# EAGLE schematic schemat (EAGLE 9.2.2)
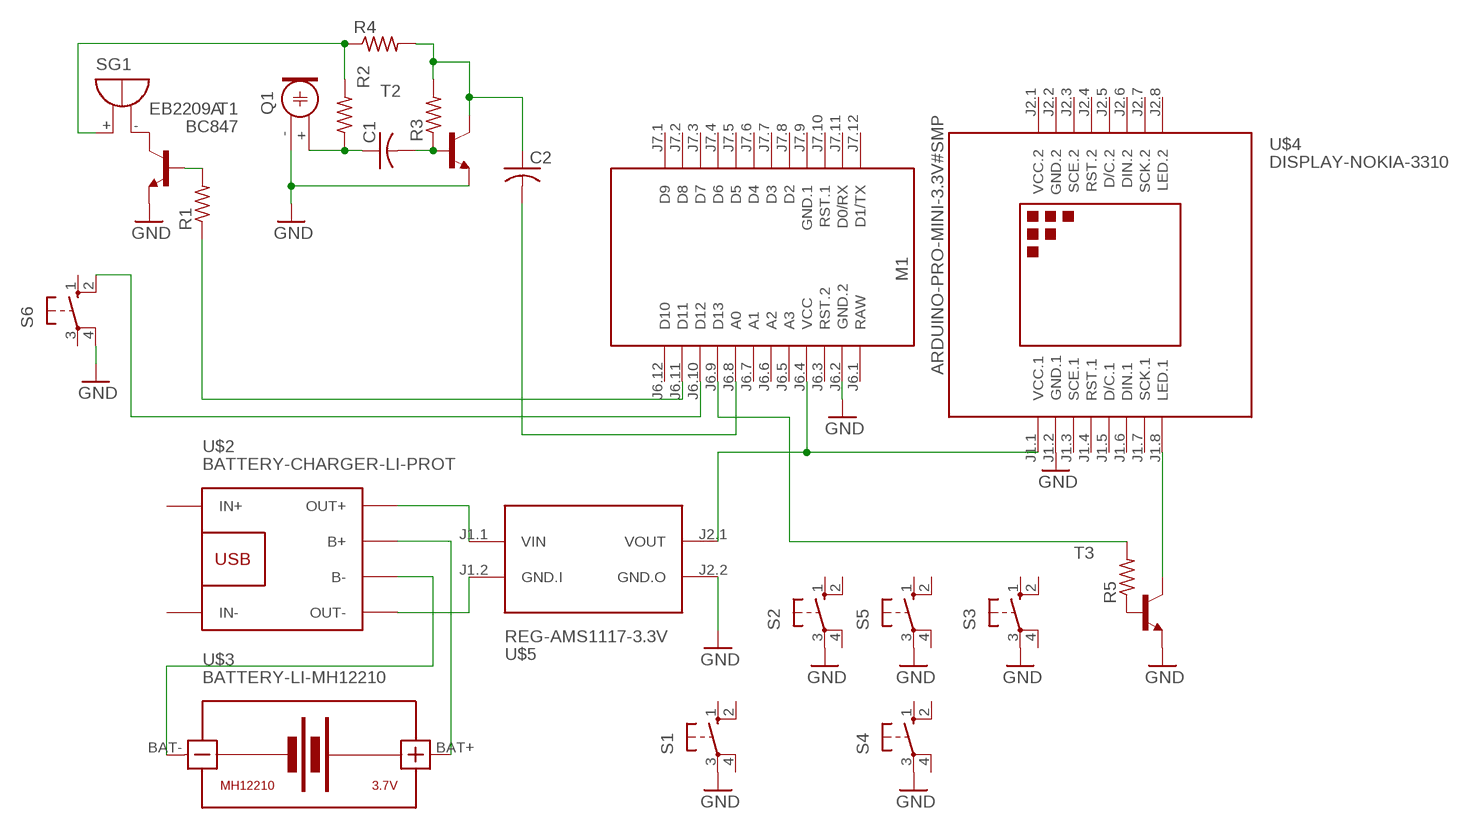
[diagram p0: schematic, sheet 1]

## Parts
C1  C-USC2012  [C2012]
C2  C-USC2012  [C2012]
M1  ARDUINO-PRO-MINI-3.3V#SMP  [ARDUINO-PRO-MINI#SMP]
Q1  ELECTRET  [9.7ELECTRET]
R1  R-US_R1206  [R1206]
R2  R-US_R1206  [R1206]
R3  R-US_R1206  [R1206]
R4  R-US_R1206  [R1206]
R5  R-US_R1206  [R1206]
S1  10-XX  [B3F-10XX]
S2  10-XX  [B3F-10XX]
S3  10-XX  [B3F-10XX]
S4  10-XX  [B3F-10XX]
S5  10-XX  [B3F-10XX]
S6  10-XX  [B3F-10XX]
SG1  EB2209A  [EB2209A]
T1  BC847  [SOT23]
T2  -NPN-SOT23-EBC  [SOT23-EBC]
T3  -NPN-SOT23-EBC  [SOT23-EBC]
U$2  BATTERY-CHARGER-LI-PROT  [BATTERY-CHARGER-LI-PROT]
U$3  BATTERY-LI-MH12210  [BATTERY-LI-MH12210]
U$4  DISPLAY-NOKIA-3310  [DISPLAY-NOKIA-3310]
U$5  REG-AMS1117-3.3V  [REG-AMS1117]

## Nets
GND: M1.J6.2(GND.2) Q1.- S1.3(P) S2.3(P) S3.3(P) S4.3(P) S5.3(P) S6.4(P1) T1.2(E) T2.E T3.E U$4.J1.2(GND.1) U$5.J2.2(GND.O)
N$1: SG1.- T1.3(C)
N$2: U$2.B- U$3.BAT-
N$3: U$2.B+ U$3.BAT+
N$4: U$2.OUT+ U$5.J1.1(VIN)
N$5: U$2.OUT- U$5.J1.2(GND.I)
N$6: R1.2 T1.1(B)
N$7: M1.J6.4(VCC) U$4.J1.1(VCC.1) U$5.J2.1(VOUT)
N$8: C1.1 Q1.+ R2.1
N$9: R2.2 R4.1 SG1.+
N$10: C1.2 R3.1 T2.B
N$11: C2.1 R3.2 R4.2 T2.C
N$12: C2.2 M1.J6.8(A0)
N$13: M1.J6.10(D12) S6.2(S1)
N$14: M1.J6.11(D11) R1.1
N$15: T3.C U$4.J1.8(LED.1)
N$16: R5.1 T3.B
N$17: M1.J6.9(D13) R5.2
Unconnected: M1.J6.3(RST.2) M1.J6.5(A3) M1.J6.6(A2) M1.J6.7(A1) M1.J6.12(D10) M1.J7.1(D9) M1.J7.2(D8) M1.J7.3(D7) M1.J7.4(D6) M1.J7.5(D5) M1.J7.6(D4) M1.J7.7(D3) M1.J7.8(D2) M1.J7.10(RST.1) M1.J7.11(D0/RX) M1.J7.12(D1/TX) S1.1(S) S1.2(S1) S1.4(P1) S2.1(S) S2.2(S1) S2.4(P1) S3.1(S) S3.2(S1) S3.4(P1) S4.1(S) S4.2(S1) S4.4(P1) S5.1(S) S5.2(S1) S5.4(P1) S6.1(S) S6.3(P) U$2.IN+ U$2.IN- U$4.J1.3(SCE.1) U$4.J1.4(RST.1) U$4.J1.5(D/C.1) U$4.J1.6(DIN.1) U$4.J1.7(SCK.1) U$4.J2.3(SCE.2) U$4.J2.4(RST.2) U$4.J2.5(D/C.2) U$4.J2.6(DIN.2) U$4.J2.7(SCK.2) U$4.J2.8(LED.2)

## Power pins joined to a net without a drawn wire
GND.1: M1.J7.9(GND.1)
GND.2: U$4.J2.2(GND.2)
RAW: M1.J6.1(RAW)
VCC.2: U$4.J2.1(VCC.2)

## Library data of the parts
C1 C2 = adafruit:C-US: CAPACITOR, American symbol
M1 = diy-modules:ARDUINO-PRO-MINI-*#SMP: Arduino Pro Mini (and compatible devices) with 2 connectors only More details available here: https://www.arduino.cc/en/Main/ArduinoBoardProMini Click here to find device on ebay.com <http://www.ebay.com/sch/arduino+pro+mini>
Q1 = adafruit:ELECTRET: Electret microphone Thru hole 2.54mm spacing with 9.7mm diameter
R1-R5 = adafruit:R-US_: RESISTOR, American symbol
S1-S6 = switch-omron:10-XX: OMRON SWITCH; MPN: B3F-1000; OC_FARNELL: 176432; OC_NEWARK: 36M3542
SG1 = buzzer:EB2209A: BUZZER Source: Buerklin; OC_FARNELL: unknown; OC_NEWARK: unknown
T1 = transistor:BC847: NPN TRANSISTOR
T2 T3 = transistor:*-NPN-: NPN Transistror BF959 corrected 2008.03.06
U$2 = diy-modules:BATTERY-CHARGER-LI-PROT: Lithium Battery 5V Charger with protection circuit More details available here: http://www.instructables.com/id/DIY-Lithium-ion-Battery-Charger/step4/TP4056-based-lithium-ion-battery-charger-module/ Click here to find device on ebay.com <http://www.ebay.com/sch/tp4056+charger+usb+protection>
U$3 = diy-modules:BATTERY-LI-MH12210: Lithium-Ion MH12210 Rechargeable Battery Panasonic NCR18650PF battery datasheet available here: https://industrial.panasonic.com/cdbs/www-data/pdf2/ACI4000/ACI4000C12.pdf Click here to find device on ebay.com <http://www.ebay.com/sch/ncr18650b+battery>
U$4 = diy-modules:DISPLAY-NOKIA-3310: 84x48 Dot Matrix LCD Module based on Nokia 3310 display More details available here: https://arduinoandsoftware.wordpress.com/2012/12/30/nokia-33105110-3-3v-display-with-5v-arduino/
U$5 = diy-modules:REG-AMS1117-*: Linear Regulator based on AMS1117 chip